# EasyEDA Pro project ProPrj_交流检测电路_2026-01-25.epro

# Schematic 交流电压检测_1
Board Name: 交流电压检测_1; Create Date: 2025-05-28; Page Name: Sheet_1; Project Name: 交流检测电路; Schematic Name: 交流电压检测_1; Update Date: 2025-07-20; Add into BOM: yes; Company: Your Company; Convert to PCB: yes; Date: 2025-02-21; Draw By: EDAdong; REV: 1.0; Sheet: 1/1
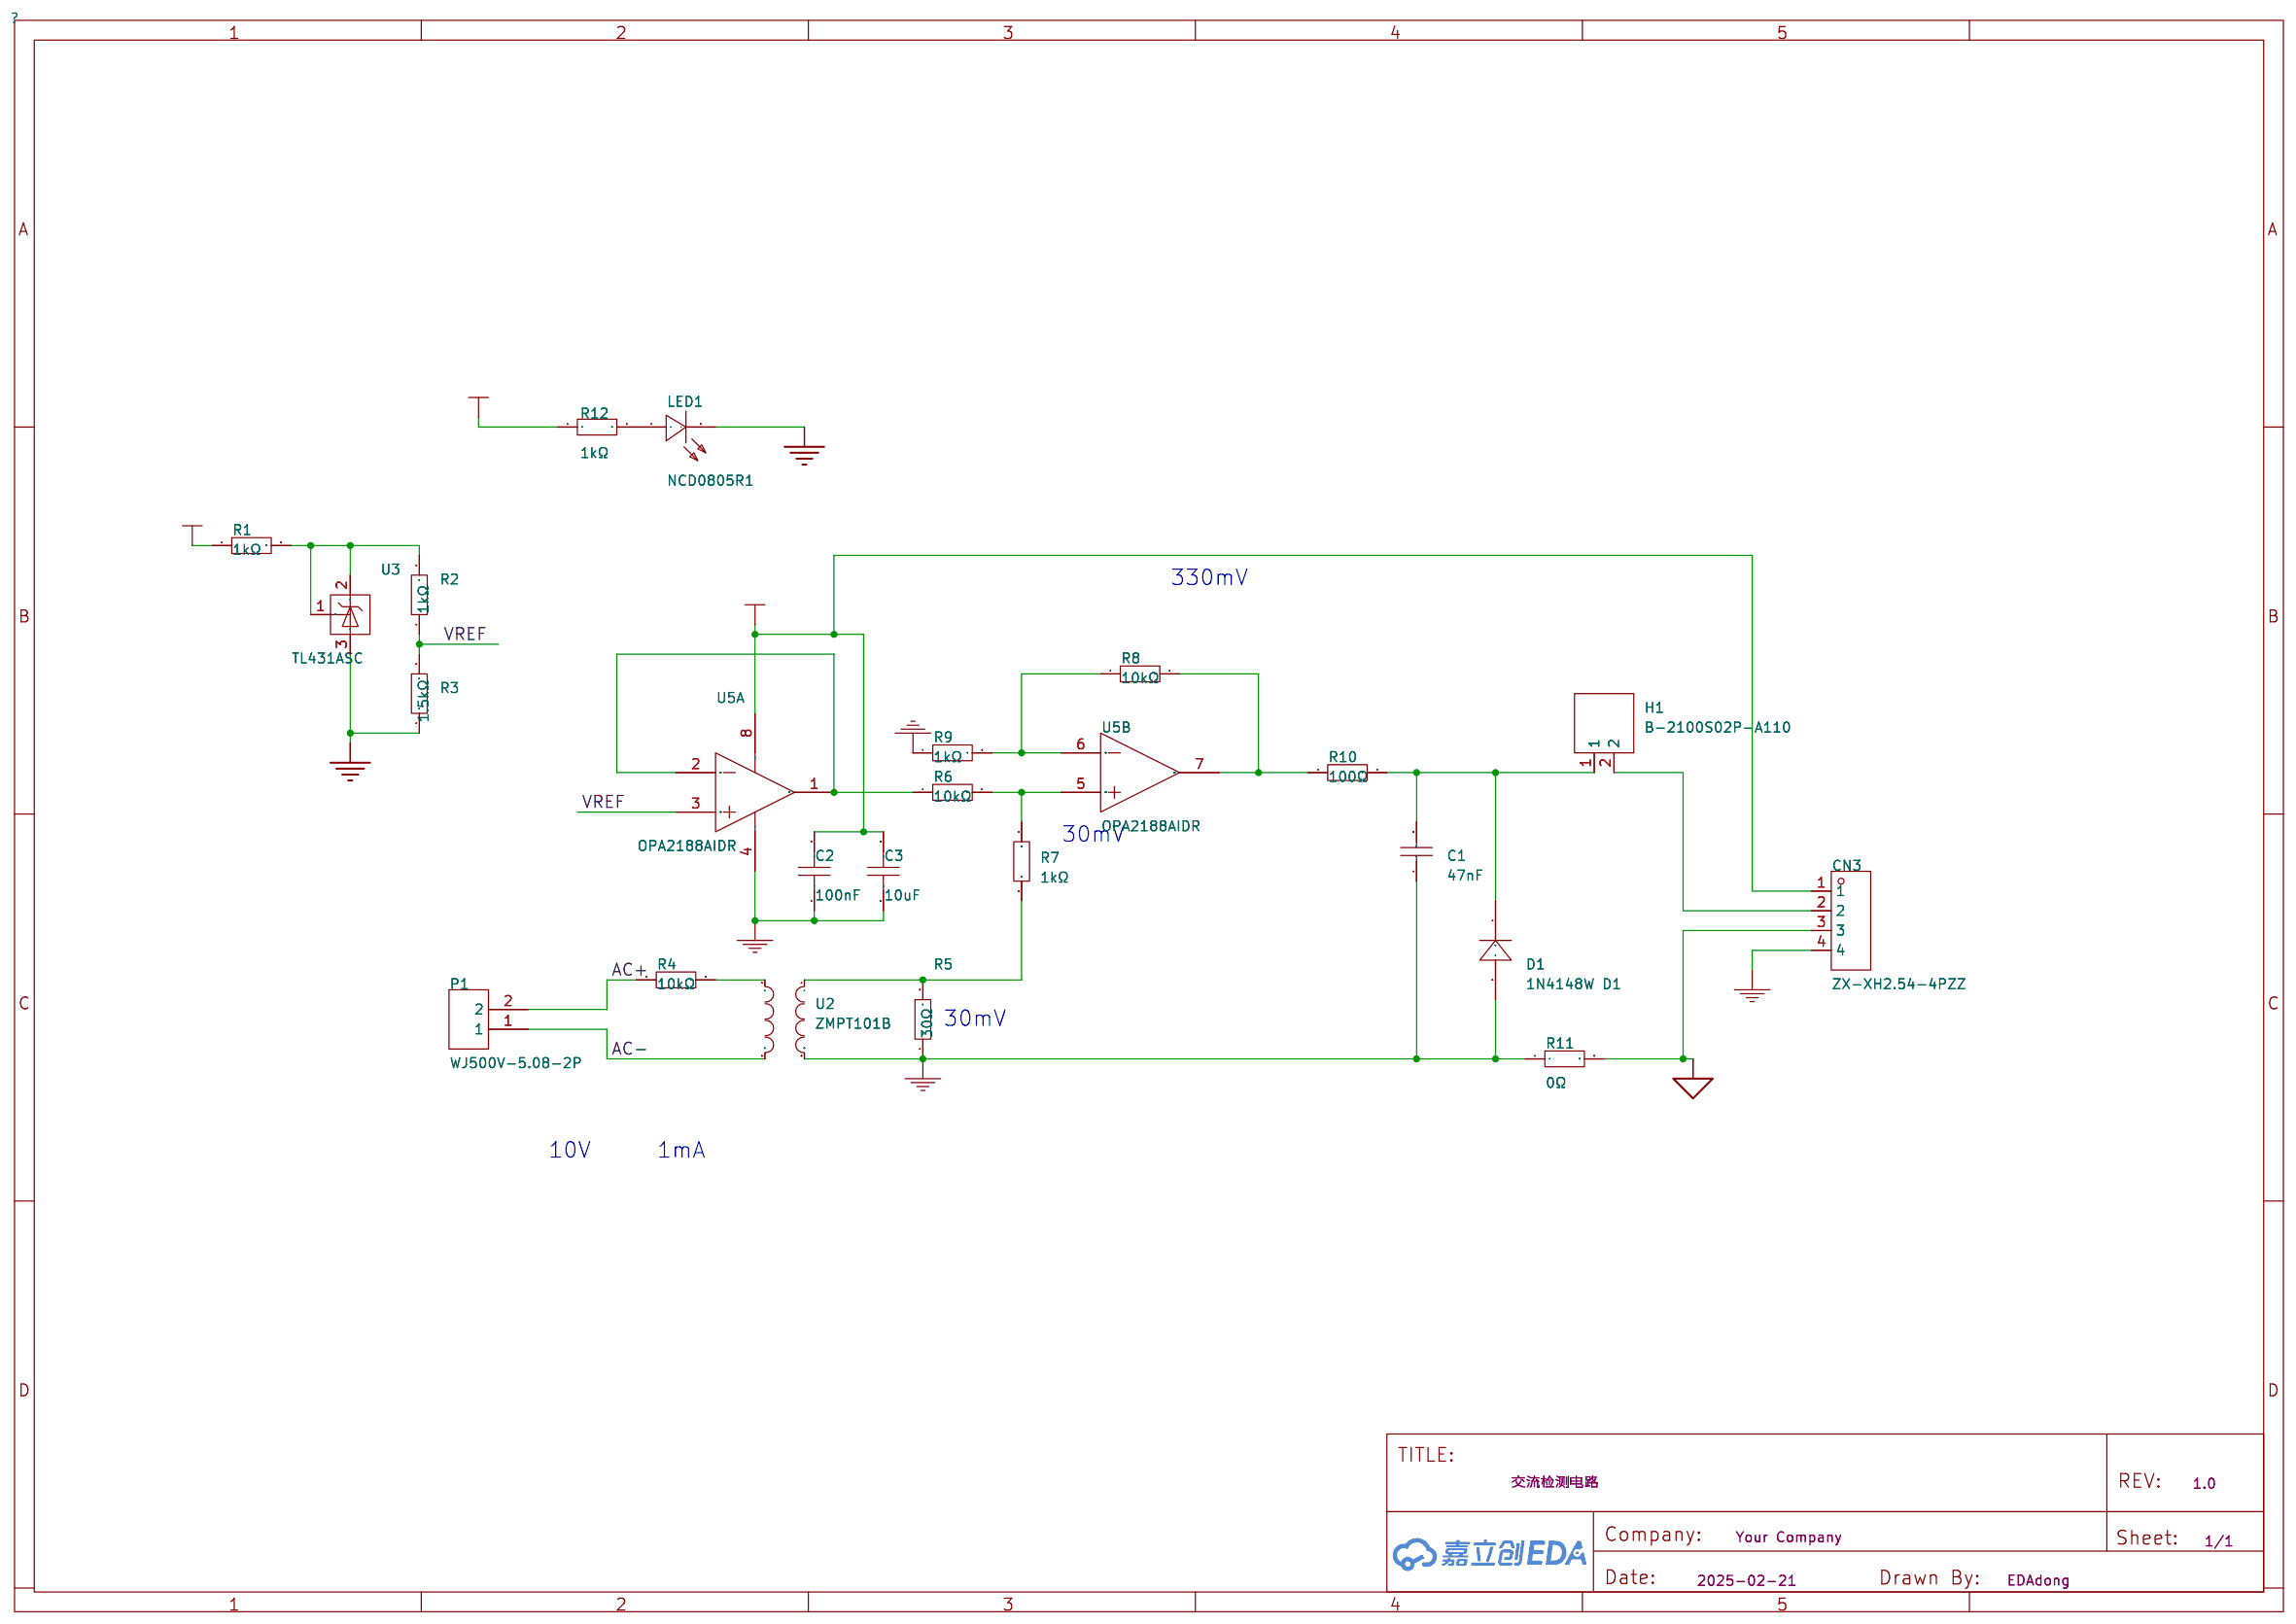
[diagram p0: schematic sheet]

## Parts
C1  47nF  [C0603]
C2  100nF  [C0603]
C3  10uF  [C0603]
CN3  ZX-XH2.54-4PZZ  [CONN-TH_4P-P2.50_4PIN]
D1  1N4148W D1  [SOD-123_L2.8-W1.8-LS3.7-RD]
H1  B-2100S02P-A110  [HDR-TH_2P-P2.54-V-M-1]
LED1  NCD0805R1  [LED0805-R-RD]
P1  WJ500V-5.08-2P  [CONN-TH_2P-P5.00_WJ500V-5.08-2P]
R1  1kΩ  [R0603]
R2  1kΩ  [R0603]
R3  1.5kΩ  [R0603]
R4  10kΩ  [R0603]
R5  30Ω  [R0603]
R6  10kΩ  [R0603]
R7  1kΩ  [R0603]
R8  10kΩ  [R0603]
R9  1kΩ  [R0603]
R10  100Ω  [R0603]
R11  0Ω  [R0603]
R12  1kΩ  [R0603]
U2  ZMPT101B  [XFMR-TH_ZMPT101B]
U3  TL431ASC  [SOT-23-3_L2.9-W1.4-P1.90-LS2.5-BR]
U5  OPA2188AIDR  [SOIC-8_L4.9-W3.9-P1.27-LS6.0-BL]  (sections 1,2)

## Library data of the parts
C1 = CL10B473KB8NNNC: 容值:47nF;精度:±10%;额定电压:50V;材质(温度系数):X7R;; LCSC Part Name: 47nF ±10% 50V; Supplier Part: C1622; Manufacturer: SAMSUNG(三星); Supplier Footprint: 0603; JLCPCB Part Class: 基础库; Datasheet: https://atta.szlcsc.com/upload/public/pdf/source/20160218/1457707763339.pdf; Supplier: LCSC; Tolerance: ±10%; Voltage Rated: 50V; Temperature Coefficient: X7R
C2 = CGA0603X7R104K500JT: 容值:100nF;精度:±10%;额定电压:50V;温度系数:X7R;; LCSC Part Name: 100nF ±10% 50V; Supplier Part: C6119867; Manufacturer: HRE(芯声); Supplier Footprint: 0603; JLCPCB Part Class: 扩展库; Datasheet: https://atta.szlcsc.com/upload/public/pdf/source/20250103/C44077DA9E7B3EFAE02F22B6D3D1CBC9.pdf; Supplier: LCSC; Tolerance: ±10%; Voltage Rating: 50V; Temperature Coefficient: X7R
C3 = CGA0603X5R106K100JT: 容值:10uF;精度:±10%;额定电压:10V;温度系数:X5R;; LCSC Part Name: 10uF ±10% 10V; Supplier Part: C6119842; Manufacturer: HRE(芯声); Supplier Footprint: 0603; JLCPCB Part Class: 扩展库; Supplier: LCSC; Tolerance: ±10%; Voltage Rating: 10V; Temperature Coefficient: X5R
CN3 = ZX-XH2.54-4PZZ: 插针结构:1x4P;间距:2.5mm;安装方式:直插;参考系列:XH;总PIN数:4P;排数:1;每排PIN数:4;行距:-;额定电流:3A;触头材质:黄铜;触头镀层:锡;工作温度:-25℃~+85℃;; LCSC Part Name: 1x4P 间距:2.5mm 直插 系列:XH; Supplier Part: C7429634; Manufacturer: Megastar(兆星); Supplier Footprint: 插件,P=2.5mm; JLCPCB Part Class: 扩展库; Datasheet: https://atta.szlcsc.com/upload/public/pdf/source/20230619/B529A2163E0159A644AB3383D208FB03.pdf; Supplier: LCSC; Pins Structure: 1x4P; Pitch: 2.5mm; Mounting Type: 直插; Reference Series: XH; Number of Pins: 4P; Number of Rows: 1; Number of PINs Per Row: 4; Current Rating: 3A; Contact Material: 黄铜; Contact Plating: 锡; Operating Temperature: -25℃~+85℃; Voltage Rating: 250V; Plastic Material: PA66; Flame Retardant Rating: UL94V-0; Color: 白色; Z-Height of the Board: 7mm; X-Length of Bottom Edge on Board (Spacing Line): 12.5mm; Y-Width of Bottom Edge on Board: 5.9mm
D1 = 1N4148W D1: 二极管配置:独立式;正向压降(Vf):1V@10mA;直流反向耐压(Vr):75V;整流电流:150mA;反向恢复时间(trr):4ns;; Supplier Part: C129216; Manufacturer: TC(德昌); Supplier Footprint: SOD-123FL; JLCPCB Part Class: 扩展库; Datasheet: https://atta.szlcsc.com/upload/public/pdf/source/20180801/C261223_C55B393283AE12365CB78B04260FB558.pdf; Supplier: LCSC; Diode Configuration: 独立式; Forward Voltage (Vf@If): 1V@10mA; Reverse Voltage (Vr): 75V; Rectified Current: 150mA; Reverse Leakage Current (Ir): 5uA@75V; Reverse Recovery Time (trr): 4ns
H1 = B-2100S02P-A110: 插针结构:1x2P;间距:2.54mm;行距:-;圆针/方针:-;安装方式:直插;排数:单排;总PIN位数:2P;额定电流:-;额定电压:-;配合针长度:6mm;塑高:2.54mm;端接针长度:3mm;触头材质:黄铜;触头镀层:-;工作温度:-40℃~+105℃;颜色:黑色;; LCSC Part Name: 1x2P 间距:2.54mm 直插; Supplier Part: C124375; Manufacturer: Ckmtw(灿科盟); Supplier Footprint: 插件,P=2.54mm; JLCPCB Part Class: 扩展库; Datasheet: https://atta.szlcsc.com/upload/public/pdf/source/20221019/2EE72DAC61CAA62C0A53546E211F9C15.pdf; Supplier: LCSC; Pin Structure: 1x2P; Pitch: 2.54mm; Mounting Type: 直插; Number of Rows: 单排; Number of Pins: 2P; Length of Mating Pin: 6mm; Insulation Height: 2.54mm; Length of End Connection Pin: 3mm; Contact Material: 黄铜; Operating Temperature: -40℃~+105℃; Color: 黑色
LED1 = NCD0805R1: 灯头类型:-;发光颜色:红色;正向电压(VF):1.6V~2.6V;功率:65mW;正向电流:20mA;主波长:615nm~630nm;二极管配置:独立二极管;透镜颜色:无色透明透镜;色温:-;发光强度:67mcd~195mcd;发光角度:130°;载带方式:-;工作温度:-30℃~+85℃;; Supplier Part: C84256; Manufacturer: 国星光电; Supplier Footprint: 0805; JLCPCB Part Class: 基础库; Datasheet: https://atta.szlcsc.com/upload/public/pdf/source/20200820/C84256_F0A75A43B3EAD75808600A0514C76B99.pdf; Supplier: LCSC; Emitted Color: 红色; Forward Voltage (VF): 1.6V~2.6V; Power Dissipation: 65mW; Forward Current: 20mA; Dominant Wavelength: 615nm~630nm; Diode Configuration: 独立二极管; Lens Color: 无色透明透镜; Luminous Intensity: 67mcd~195mcd; Viewing Angle: 130°; Operating Temperature: -30℃~+85℃
P1 = WJ500V-5.08-2P: 结构:1x2P;间距:5.08mm;颜色:绿色;安装方式:直插;额定电流:18A;额定电压:250V;排数:1;线规 - AWG:14~30;线规 - 平方毫米:2.5;每排PIN数:2;触头材质:-;触头镀层:-;工作温度范围:-40℃~+105℃;焊接温度(最大值):-;; LCSC Part Name: 1x2P 5.08mm 直插 排数:1 每排P数:2; Supplier Part: C8465; Manufacturer: KANGNEX(康奈克斯电气); Supplier Footprint: 插件,P=5.08mm; JLCPCB Part Class: 扩展库; Datasheet: https://atta.szlcsc.com/upload/public/pdf/source/20191225/C8465_02D34CE5B5B4A53DF5891601D97FA9F4.pdf; Supplier: LCSC; Structure: 1x2P; Pitch: 5.08mm; Color: 绿色; Mounting Style: 直插; Current Rating (Max): 18A; Voltage Rating (Max): 250V; Number of Pins: 2P; Number of Rows: 1; Wire Gauge - AWG: 14~30; Wire Gauge - mm2: 2.5; Number of PINs Per Row: 2; Operating Temperature Range: -40℃~+105℃; Screw Specification: M2.5
R1 R2 R7 R9 R12 = 0603WAF1001T5E: 电阻类型:厚膜电阻;阻值:1kΩ;精度:±1%;功率:100mW;最大工作电压:75V;温度系数:±100ppm/℃;; LCSC Part Name: 1kΩ ±1% 100mW 厚膜电阻; Supplier Part: C21190; Manufacturer: UNI-ROYAL(厚声); Supplier Footprint: 0603; JLCPCB Part Class: 基础库; Datasheet: https://atta.szlcsc.com/upload/public/pdf/source/20200306/C422600_1E6D84923E4A46A82E41ADD87F860B5C.pdf; Supplier: LCSC; Type: 厚膜电阻; Tolerance: ±1%; Power(Watts): 100mW; Overload Voltage (Max): 75V; Temperature Coefficient: ±100ppm/℃; Operating Temperature Range: -55℃~+155℃
R3 = 0603WAF1501T5E: 电阻类型:厚膜电阻;阻值:1.5kΩ;精度:±1%;功率:100mW;最大工作电压:75V;温度系数:±100ppm/℃;; LCSC Part Name: 1.5kΩ ±1% 100mW 厚膜电阻; Supplier Part: C22843; Manufacturer: UNI-ROYAL(厚声); Supplier Footprint: 0603; JLCPCB Part Class: 基础库; Datasheet: https://atta.szlcsc.com/upload/public/pdf/source/20200306/C422600_1E6D84923E4A46A82E41ADD87F860B5C.pdf; Supplier: LCSC; Type: 厚膜电阻; Tolerance: ±1%; Power(Watts): 100mW; Overload Voltage (Max): 75V; Temperature Coefficient: ±100ppm/℃; Operating Temperature Range: -55℃~+155℃
R4 R6 R8 = 0603WAF1002T5E: 电阻类型:厚膜电阻;阻值:10kΩ;精度:±1%;功率:100mW;最大工作电压:75V;温度系数:±100ppm/℃;; LCSC Part Name: 厚膜电阻 10kΩ ±1% 100mW; Supplier Part: C25804; Manufacturer: UNI-ROYAL(厚声); Supplier Footprint: 0603; JLCPCB Part Class: 基础库; Datasheet: https://atta.szlcsc.com/upload/public/pdf/source/20200306/C422600_1E6D84923E4A46A82E41ADD87F860B5C.pdf; Supplier: LCSC; Type: 厚膜电阻; Tolerance: ±1%; Power(Watts): 100mW; Overload Voltage (Max): 75V; Temperature Coefficient: ±100ppm/℃; Operating Temperature Range: -55℃~+155℃
R5 = 0603WAF300JT5E: 电阻类型:厚膜电阻;阻值:30Ω;精度:±1%;功率:100mW;最大工作电压:75V;温度系数:±100ppm/℃;; LCSC Part Name: 30Ω ±1% 100mW 厚膜电阻; Supplier Part: C22985; Manufacturer: UNI-ROYAL(厚声); Supplier Footprint: 0603; JLCPCB Part Class: 扩展库; Datasheet: https://atta.szlcsc.com/upload/public/pdf/source/20200306/C422600_1E6D84923E4A46A82E41ADD87F860B5C.pdf; Supplier: LCSC; Type: 厚膜电阻; Tolerance: ±1%; Power(Watts): 100mW; Overload Voltage (Max): 75V; Temperature Coefficient: ±100ppm/℃; Operating Temperature Range: -55℃~+155℃
R10 = 0603WAF1000T5E: 电阻类型:厚膜电阻;阻值:100Ω;精度:±1%;功率:100mW;最大工作电压:75V;温度系数:±200ppm/℃;; LCSC Part Name: 100Ω ±1% 100mW 厚膜电阻; Supplier Part: C22775; Manufacturer: UNI-ROYAL(厚声); Supplier Footprint: 0603; JLCPCB Part Class: 基础库; Datasheet: https://atta.szlcsc.com/upload/public/pdf/source/20200306/C422600_1E6D84923E4A46A82E41ADD87F860B5C.pdf; Supplier: LCSC; Type: 厚膜电阻; Tolerance: ±1%; Power(Watts): 100mW; Overload Voltage (Max): 75V; Temperature Coefficient: ±200ppm/℃; Operating Temperature Range: -55℃~+155℃
R11 = 0603WAF0000T5E: 电阻类型:厚膜电阻;阻值:0Ω;精度:±1%;功率:100mW;最大工作电压:75V;; LCSC Part Name: 0Ω ±1% 100mW 厚膜电阻; Supplier Part: C21189; Manufacturer: UNI-ROYAL(厚声); Supplier Footprint: 0603; JLCPCB Part Class: 基础库; Datasheet: https://atta.szlcsc.com/upload/public/pdf/source/20200306/C422600_1E6D84923E4A46A82E41ADD87F860B5C.pdf; Supplier: LCSC; Type: 厚膜电阻; Tolerance: ±1%; Power(Watts): 100mW; Overload Voltage (Max): 75V; Operating Temperature Range: -55℃~+155℃
U2 = ZMPT101B: 匝数比:-;额定输入电流:-;次级侧电感值:-;; Supplier Part: C111858; Manufacturer: 择明朗熙; Supplier Footprint: 插件; JLCPCB Part Class: 扩展库; Datasheet: https://atta.szlcsc.com/upload/public/pdf/source/20180620/C111858_8009DF6588FC1E1F0188704039E5D8C5.pdf; Supplier: LCSC
U3 = TL431ASC: 输出类型:可调;工作电压:-;输出电压:2.495V~36V;输出电流:100mA;精度:±0.5%;; LCSC Part Name: TL431ASC（±0.5%）; Supplier Part: C41784037; Manufacturer: PJSEMI(平晶微); Supplier Footprint: SOT-23-3; JLCPCB Part Class: 扩展库; Datasheet: https://atta.szlcsc.com/upload/public/pdf/source/20240522/F011E22C91BF151C1DC0D285892A7E9E.pdf; Supplier: LCSC; Output Type: 可调; Output Voltage: 2.495V~36V; Output Current: 100mA; Tolerance: ±0.5%; Reference Type: 串联; Minimum Cathode Current for Regulation: 450uA; Dynamic Impedance: 500mΩ; Operating Temperature: -40℃~+125℃
U5 = OPA2188AIDR: 放大器数:双路;增益带宽积(GBP):2MHz;输入偏置电流(Ib):160pA;输入失调电压(Vos):6uV;压摆率(SR):0.8V/us;带宽(-3db):-;轨到轨:-;; LCSC Part Name: OPA2188AIDR  零漂移; Supplier Part: C17271; Manufacturer: TI(德州仪器); Supplier Footprint: SOIC-8; JLCPCB Part Class: 扩展库; Datasheet: https://www.ti.com/cn/lit/gpn/opa2188; Supplier: LCSC; Number of Circuits: 双路; Gain Bandwidth Product(GBP): 2MHz; Current - Input Bias(Ib): 160pA; Voltage - Input Offset(Vos): 6uV; Slew Rate(SR): 0.8V/us; Supply Current: 415uA; Operating Temperature: -40℃~+105℃

## Nets
+5V: C2.2 C3.2 CN3.1 R1.1 R12.1 U5.8(V+)
AGND: CN3.3 R11.2
GND: C1.1 C2.1 C3.1 CN3.4 D1.2(A) LED1.2(-) R3.1 R5.1 R9.1 R11.1 U2.3 U3.3(A) U5.4(V-)
AC+: P1.2 R4.1
AC-: P1.1 U2.2
VREF: R2.1 R3.2 U5.3(IN A+)
$1N2: R1.2 R2.2 U3.1(R) U3.2(K)
$1N6: R4.2 U2.1
$1N9: R5.2 R7.1 U2.4
$1N12: R6.1 U5.1(OUT A) U5.2(IN A-)
$1N14: R6.2 R7.2 U5.5(IN B+)
$1N15: R8.1 R9.2 U5.6(IN B-)
$1N16: R8.2 R10.1 U5.7(OUT B)
$1N17: C1.2 D1.1(C) H1.1 R10.2
$1N21: CN3.2 H1.2
$1N2664: LED1.1(+) R12.2

## Notes on the sheet
- 330mV
- 30mV
- 30mV
- 10V
- 1mA

# Schematic 交流电流检测
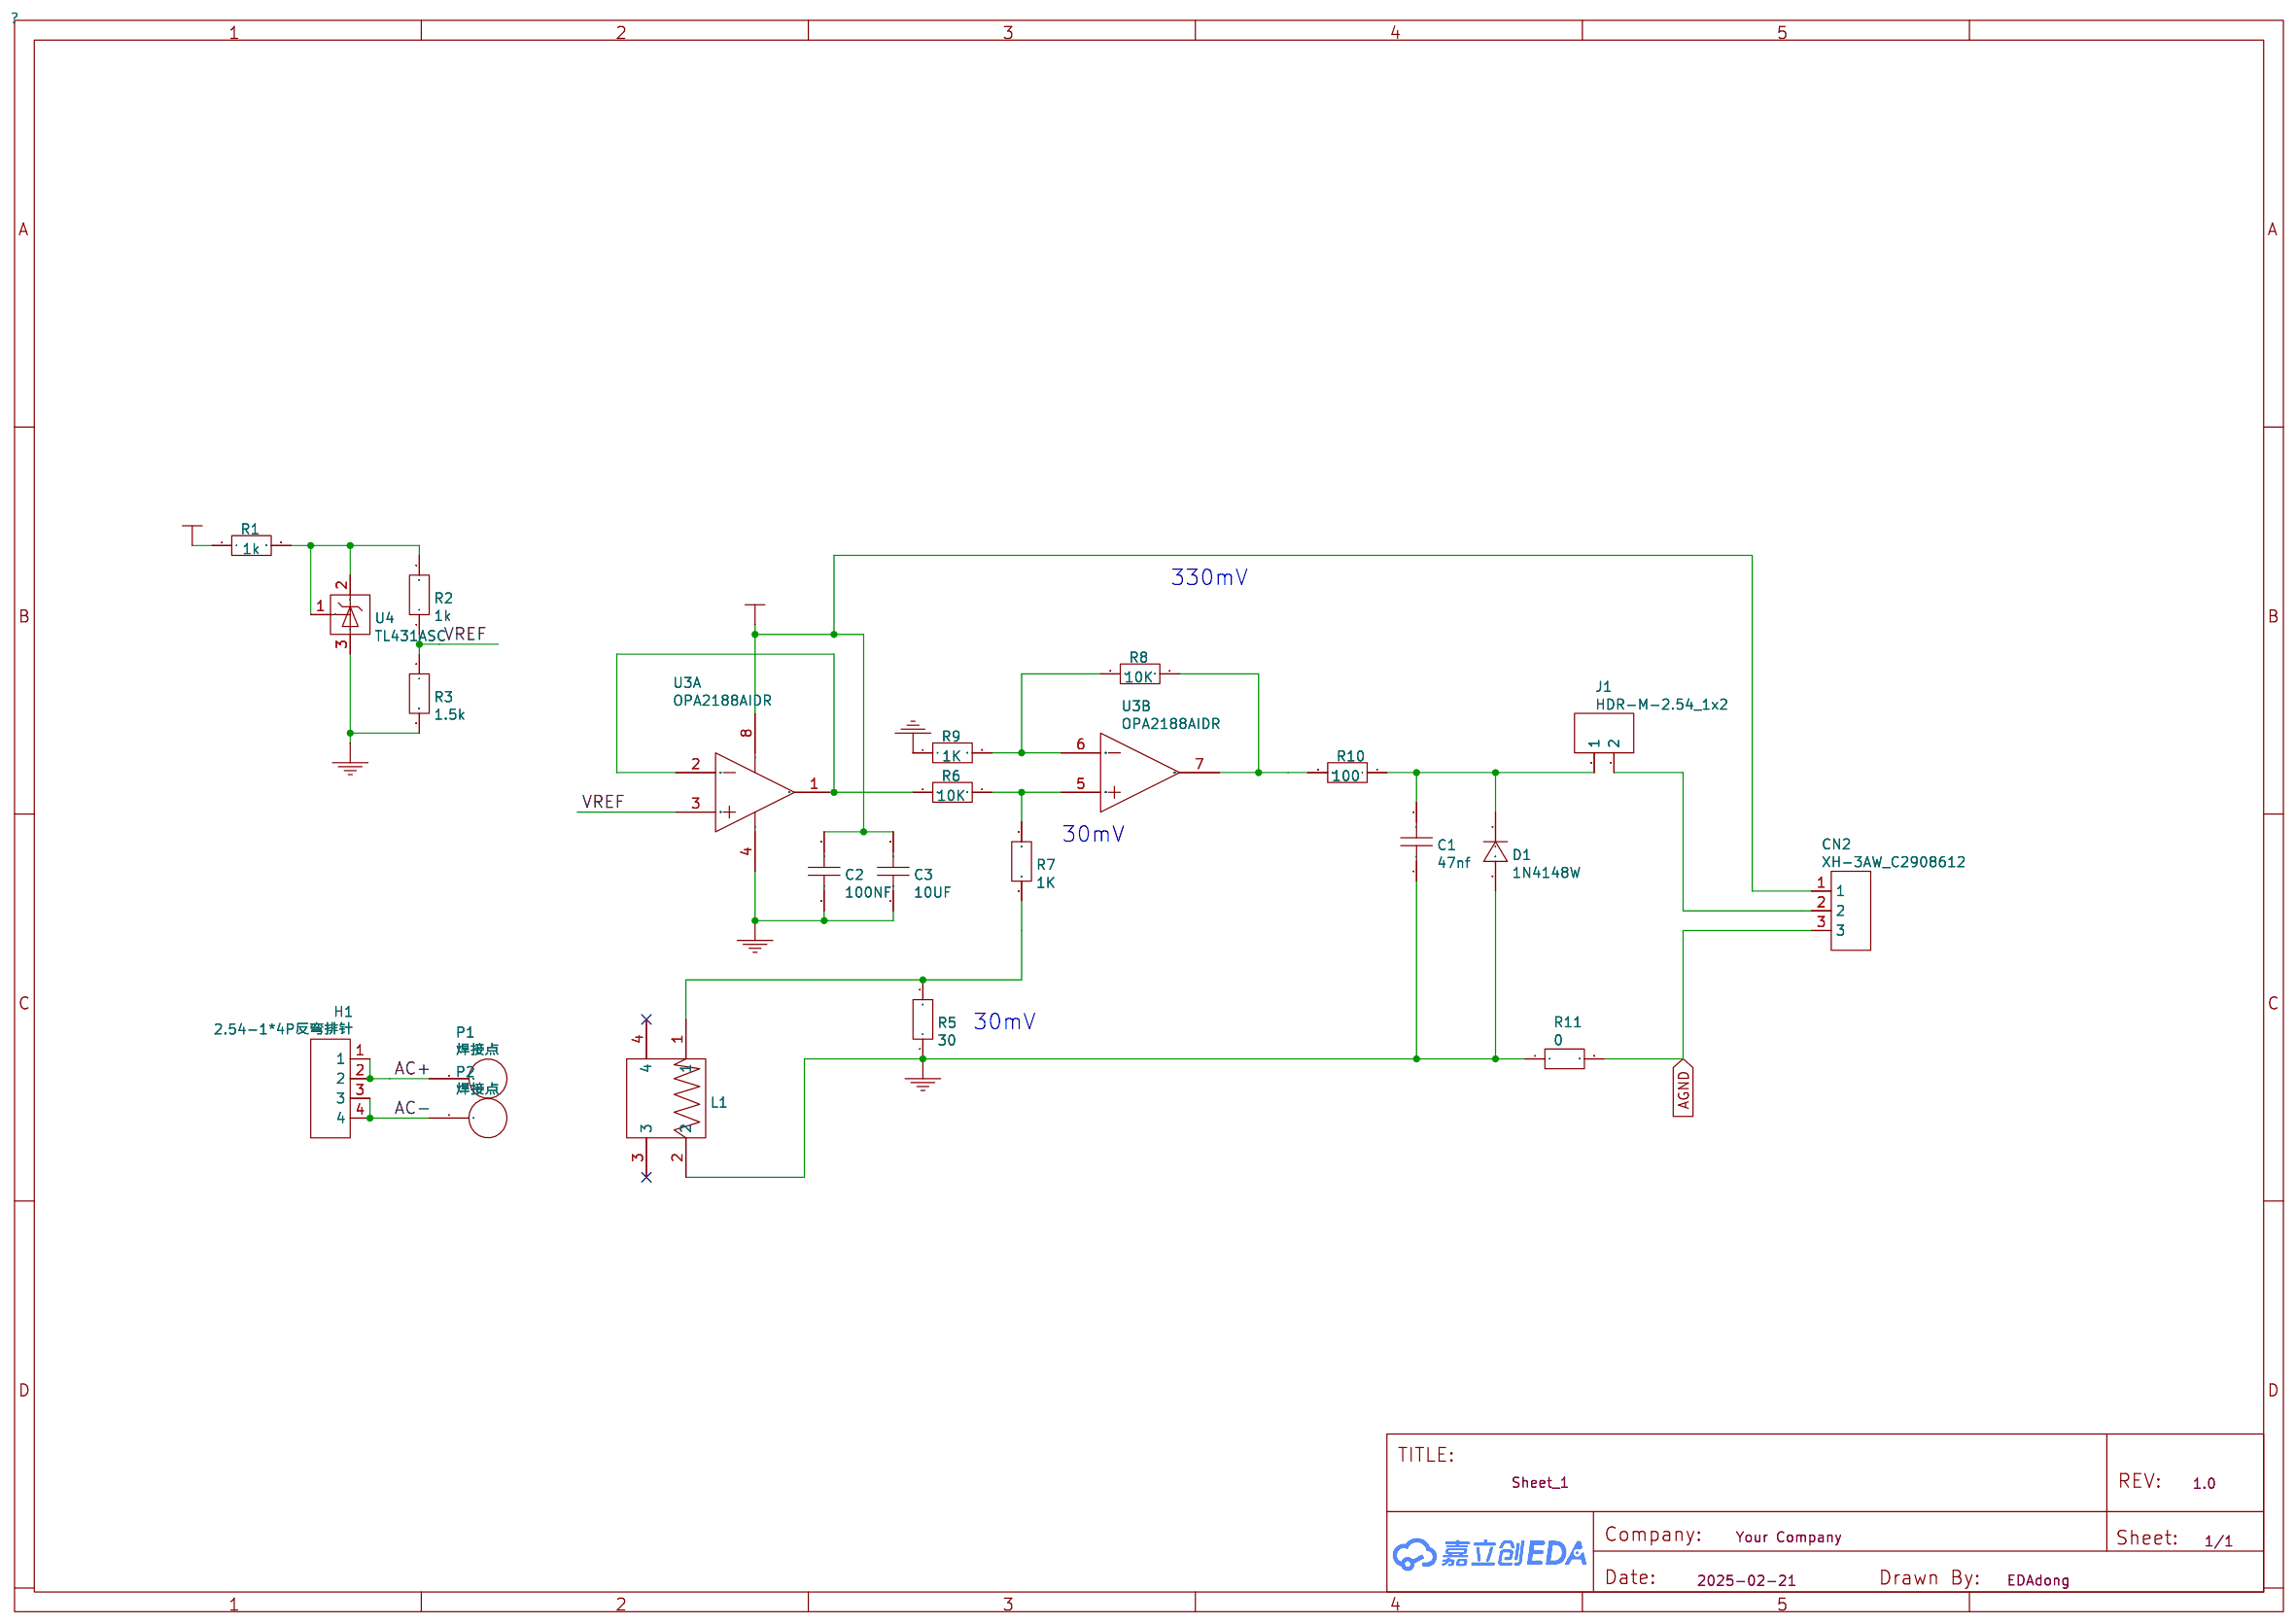
[diagram p1: schematic sheet]

## Parts
C1  47nf
C2  100NF
C3  10UF
CN2  XH-3AW_C2908612
D1  1N4148W
H1  2.54-1*4P反弯排针
J1  HDR-M-2.54_1x2
L1  ZMCT118F
P1  焊接点
P2  焊接点
R1  1k
R2  1k
R3  1.5k
R5  30
R6  10K
R7  1K
R8  10K
R9  1K
R10  100
R11  0
U3  OPA2188AIDR  (sections 1,2)
U4  TL431ASC

## Library data of the parts
C1 = 47nf
C2 = 100NF
C3 = 10UF
CN2 = XH-3AW_C2908612: Supplier: LCSC; Supplier Part: C2908612; Manufacturer: HCTL(华灿天禄); Manufacturer Part: XH-3AW; JLCPCB Part Class: Extended Part
D1 = 1N4148W: Supplier: LCSC; Manufacturer: Tak Cheong; Supplier Part: C129216
H1 = 2.54-1*4P反弯排针: Supplier: LCSC; Supplier Part: C91552; Manufacturer: BOOMELE(博穆精密); JLCPCB Part Class: Extended Part
J1 = HDR-M-2.54_1x2: Supplier Part: C124375; Supplier: LCSC
L1 = ZMCT118F: Supplier: LCSC; Manufacturer: ZEMING; Supplier Part: C173174; JLCPCB Part Class: Extended Part
P1 P2 = 焊接点
R1 R7 R9 = 1K
R2 = 1k
R3 = 1.5k
R5 = 30
R6 R8 = 10K
R10 = 100
R11 = 0
U3 = OPA2188AIDR: tags: Precision Operational Amplifier; image: http://image.lceda.cn/szlcsc/C17271.jpg; Supplier Part: C17271; Supplier: LCSC; Manufacturer: TI(德州仪器); JLCPCB Part Class: Extended Part
U4 = TL431ASC: Supplier: LCSC; Supplier Part: C41784037; Manufacturer: PJSEMI(平晶微)

## Nets
+5V: C2.2 C3.2 CN2.1 R1.1 U3.8(V+)
AGND: CN2.3 R11.2
GND: C1.1 C2.1 C3.1 D1.2 L1.2 R3.2 R5.1 R9.1 R11.1 U3.4(V-) U4.3(A)
AC+: H1.1 H1.2 P1.1
AC-: H1.3 H1.4 P2.1
VREF: R2.1 R3.1 U3.3(IN A+)
Net-(C1-2): C1.2 D1.1 J1.1 R10.1
Net-(CN2-2): CN2.2 J1.2
Net-(L1-1): L1.1 R5.2 R7.2
Net-(R1-2): R1.2 R2.2 U4.1(R) U4.2(K)
Net-(R6-1): R6.1 R7.1 U3.5(IN B+)
Net-(R6-2): R6.2 U3.1(OUT A) U3.2(IN A-)
Net-(R8-1): R8.1 R10.2 U3.7(OUT B)
Net-(R8-2): R8.2 R9.2 U3.6(IN B-)

Not connected (* = marked no-connect by the designer): L1 3* 4*

## Notes on the sheet
- 330mV
- 30mV
- 30mV

# Board PCB4
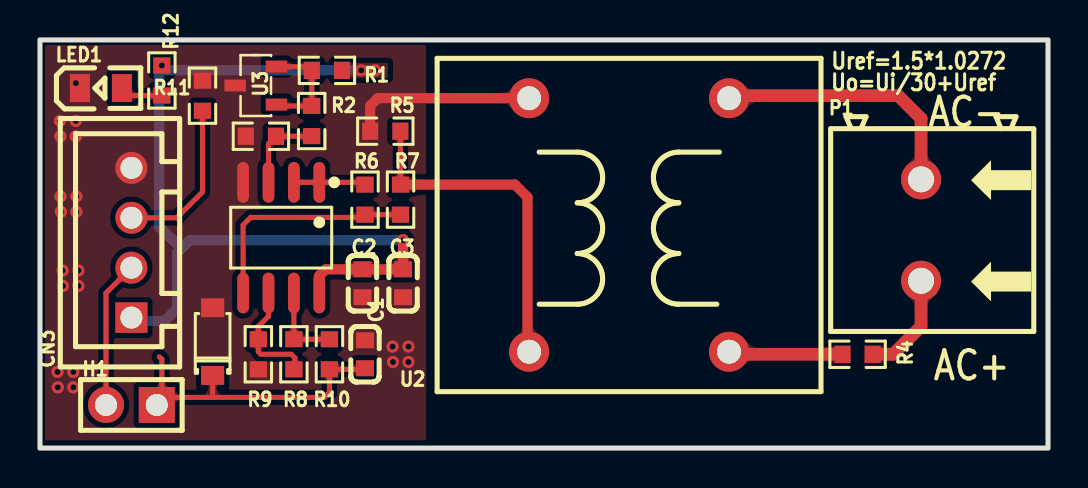
[diagram p2: board, top side]
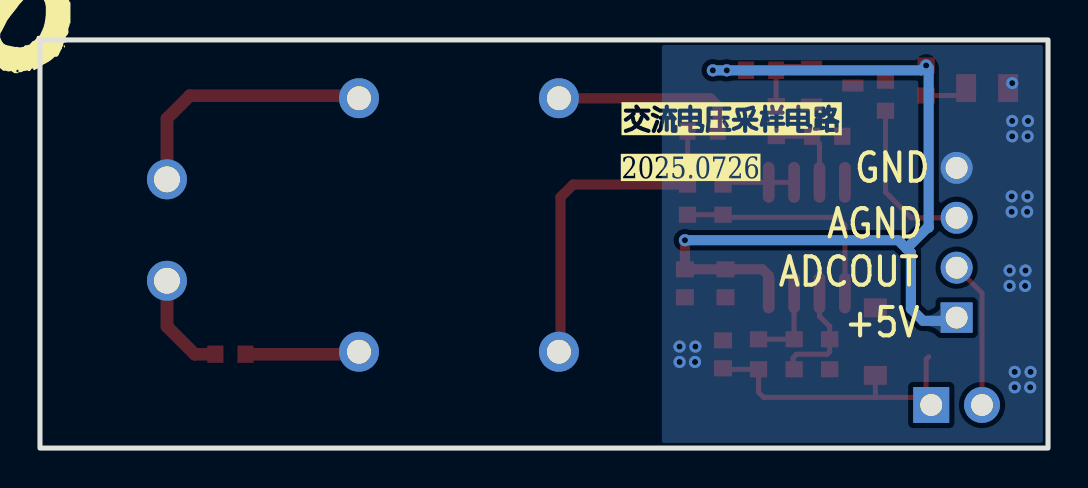
[diagram p3: board, bottom side, seen from below]

Outline 50.42 x 20.45 mm; copper layers: Top Layer, Bottom Layer. Coordinates in mm from the lower left corner of the outline.
Outline path: rectangle 0,20.45 50.42,0
Stack: Top Layer 0.035mm / Dielectric1 1.51mm FR4 er 4.5 / Bottom Layer 0.035mm

## Design rules (mm)
template: 自定义配置
spacing copperThickness1oz (default): track to track 0.102, other pairs 0.152 to 0.3
spacing copperThickness2oz: track to track 0.203, other pairs 0.152 to 0.3
track width copperThickness1oz (default): min 0.127, default 0.254, max 2.54
track width copperThickness2oz: min 0.203, default 0.254, max 2.54
differential pair differentialPair (default): width min 0.127, default 0.254, max 2.54; gap min 0.152, default 0.152
via viaSize (default): diameter min 0.5, default 0.61, max 10; hole min 0.3, default 0.305, max 6.3

## Placement (name value [footprint] x y rotation side)
C1  47nF  [C0603]  16.26 4.7 270 top
C2  100nF  [C0603]  16.13 8.25 90 top
C3  10uF  [C0603]  18.16 8.25 90 top
CN3  ZX-XH2.54-4PZZ  [CONN-TH_4P-P2.50_4PIN]  4.57 10.29 90 top
D1  1N4148W D1  [SOD-123_L2.8-W1.8-LS3.7-RD]  8.64 5.33 90 top
H1  B-2100S02P-A110  [HDR-TH_2P-P2.54-V-M-1]  4.57 2.16 180 top
LED1  NCD0805R1  [LED0805-R-RD]  3.05 18.03 0 top
P1  WJ500V-5.08-2P  [CONN-TH_2P-P5.00_WJ500V-5.08-2P]  44.07 10.92 270 top
R1  1kΩ  [R0603]  14.35 18.92 180 top
R2  1kΩ  [R0603]  13.59 16.38 90 top
R3  1.5kΩ  [R0603]  11.05 15.62 0 top
R4  10kΩ  [R0603]  40.89 4.7 180 top
R5  30Ω  [R0603]  17.27 15.88 0 top
R6  10kΩ  [R0603]  16.26 12.45 270 top
R7  1kΩ  [R0603]  18.03 12.45 270 top
R8  10kΩ  [R0603]  12.7 4.7 90 top
R9  1kΩ  [R0603]  10.92 4.7 90 top
R10  100Ω  [R0603]  14.48 4.7 270 top
R11  0Ω  [R0603]  8.13 17.65 270 top
R12  1kΩ  [R0603]  6.1 18.41 270 top
U2  ZMPT101B  [XFMR-TH_ZMPT101B]  29.46 11.18 180 top
U3  TL431ASC  [SOT-23-3_L2.9-W1.4-P1.90-LS2.5-BR]  10.8 18.16 0 top
U5  OPA2188AIDR  [SOIC-8_L4.9-W3.9-P1.27-LS6.0-BL]  12.07 10.54 180 top

## Footprints (pads in the part's own frame, mm; a bottom-side part is the same pattern mirrored in y, then rotated)
C0603
  rect 0.8x0.9 smd: 1(-0.7,0) 2(0.7,0)
CONN-TH_2P-P5.00_WJ500V-5.08-2P
  round 2 hole 1.3: 1(-2.54,0) 2(2.54,0)
CONN-TH_4P-P2.50_4PIN
  rect 1.524x1.6 hole 1.1: 1(-3.75,0)
  round 1.6 hole 1.1: 2(-1.25,0) 3(1.25,0) 4(3.75,0)
HDR-TH_2P-P2.54-V-M-1
  rect 1.8x1.8 hole 1.1: 1(-1.27,0)
  round 1.8 hole 1.1: 2(1.27,0)
LED0805-R-RD
  rect 1x1.399 smd: 1(1.05,0) 2(-1.05,0)
R0603
  rect 0.806x0.864 smd: 1(-0.753,0) 2(0.753,0)
SOD-123_L2.8-W1.8-LS3.7-RD
  rect 0.95x1.15 smd: 1(-1.692,0) 2(1.692,0)
SOIC-8_L4.9-W3.9-P1.27-LS6.0-BL
  oval 0.588x2.045 smd: 1(-1.905,-2.772) 2(-0.635,-2.772) 3(0.635,-2.772) 4(1.905,-2.772) 5(1.905,2.772) 6(0.635,2.772) 7(-0.635,2.772) 8(-1.905,2.772)
SOT-23-3_L2.9-W1.4-P1.90-LS2.5-BR
  rect 1.07x0.6 smd: 1(1.035,-0.95) 2(1.035,0.95) 3(-1.035,0)
XFMR-TH_ZMPT101B
  round 2 hole 1.2: 1(-5,6.35) 2(-5,-6.35) 3(5,-6.35) 4(5,6.35)

## Nets
As in the schematic.

## Via types
v1: diameter 0.61, hole 0.305, Top Layer to Bottom Layer, 25 vias

## Routing (per net, layer and track width the routed paths; a pad name or vN(x,y) marks a point on that pad's centre or on a via; arc(x,y) is an arc through that point)
+5V: length 44.1
  Top Layer w0.508: v1(18.16,10.41) C3.2 C2.2 14.29,8.95 13.97,8.64 U5.8
  Bottom Layer w0.508: 7.08,10 6.86,9.78 6.86,6.98 6.24,6.37 4.74,6.37 CN3.1 ; 7.08,10 7.49,10.41 v1(18.16,10.41) ; 7.08,10 6.02,11.05 5.97,11.05 5.97,19.04 v1(6.1,19.17) 6.34,18.92 v1(16.07,18.92) v1(16.76,18.92)
AGND: length 7.8
  Top Layer w0.254: 4.93,11.54 6.84,11.54 8.13,12.83 R11.2
GND: length 9.4
  Top Layer w0.508: U2.3 16.89,17.53 16.52,17.15 R5.1
  vias: v1(0.87,3.81) v1(0.89,3.04) v1(1,16.39) v1(1.02,15.62) v1(1.03,12.61) v1(1.04,11.84) v1(1.13,8.89) v1(1.15,8.12) v1(1.67,3.81) v1(1.67,3.04) v1(1.79,18.28) v1(1.79,16.39) v1(1.79,15.62) v1(1.82,12.61) v1(1.82,11.84) v1(1.92,8.89) v1(1.92,8.12) v1(17.64,5.08) v1(17.66,4.31) v1(18.43,5.08) v1(18.43,4.31)
AC+: length 5.3
  Top Layer w0.635: P1.2 44.07,6.1 42.67,4.7 R4.1
AC-: length 13.2
  Top Layer w0.635: U2.2 34.59,17.65 42.93,17.65 44.07,16.51 P1.1
VREF: length 4.3
  Top Layer w0.254: U5.3 11.43,15.25 R3.2 13.58,15.62 R2.1
$1N2: length 5.4
  Top Layer w0.254: U3.1 11.9,17.14 R2.2 13.6,17.14 R1.2 13.41,19.11 U3.2
$1N6: length 5.7
  Top Layer w0.635: R4.2 34.59,4.7 34.46,4.83
$1N9: length 17.1
  Top Layer w0.254: R7.1 18.03,13.21 R5.2
  Top Layer w0.508: 24.46,4.83 24.38,4.91 24.38,12.57 23.76,13.2 R7.1
$1N12: length 3.6
  Top Layer w0.254: U5.2 U5.1 16.14,13.31 R6.1
$1N14: length 11.5
  Top Layer w0.254: U5.5 10.16,11.18 10.54,11.56 16.12,11.56 R6.2 R7.2
$1N15: length 5.7
  Top Layer w0.254: R8.1 12.75,4 12.75,4.52 12.57,4.7 11.05,4.7 10.92,4.83 R9.2 10.92,6.1 11.43,6.6 U5.6
$1N16: length 4.1
  Top Layer w0.254: R10.1 R8.2 U5.7
$1N17: length 14.5
  Top Layer w0.254: D1.1 8.64,2.54 ; 8.64,2.54 14.22,2.54 14.48,2.79 R10.2 16.2,3.95 C1.2 ; 8.64,2.54 6.35,2.54 6.1,2.79 6.1,4.44 5.97,4.57
$1N21: length 7.4
  Top Layer w0.254: CN3.2 3.3,7.77 3.3,2.16
$1N2664: length 2.5
  Top Layer w0.254: R12.2 4.47,17.66 3.84,18.29

## Copper pours and planes (outline as drawn; the poured copper is in the pictures)
+5V on Top Layer: 14.73,19.3 17.4,19.3 17.4,18.54 14.73,18.54
GND on Top Layer: -1.65,22.22 51.56,22.22 51.56,0.38 -1.65,0.38
GND on Bottom Layer: -1.27,21.46 50.93,21.46 50.93,-2.67 -1.27,-2.67

Small or netless copper shapes (teardrops, artwork), in the pictures only: 56 on Top Layer, 6 on Bottom Layer

## Text on the board
Bottom Silkscreen Layer: GND | +5V | AGND | ADCOUT | 交流电压采样电路 | 2025.0726
Top Silkscreen Layer: Uo=Ui/30+Uref | Uref=1.5*1.0272 | AC- | AC+
